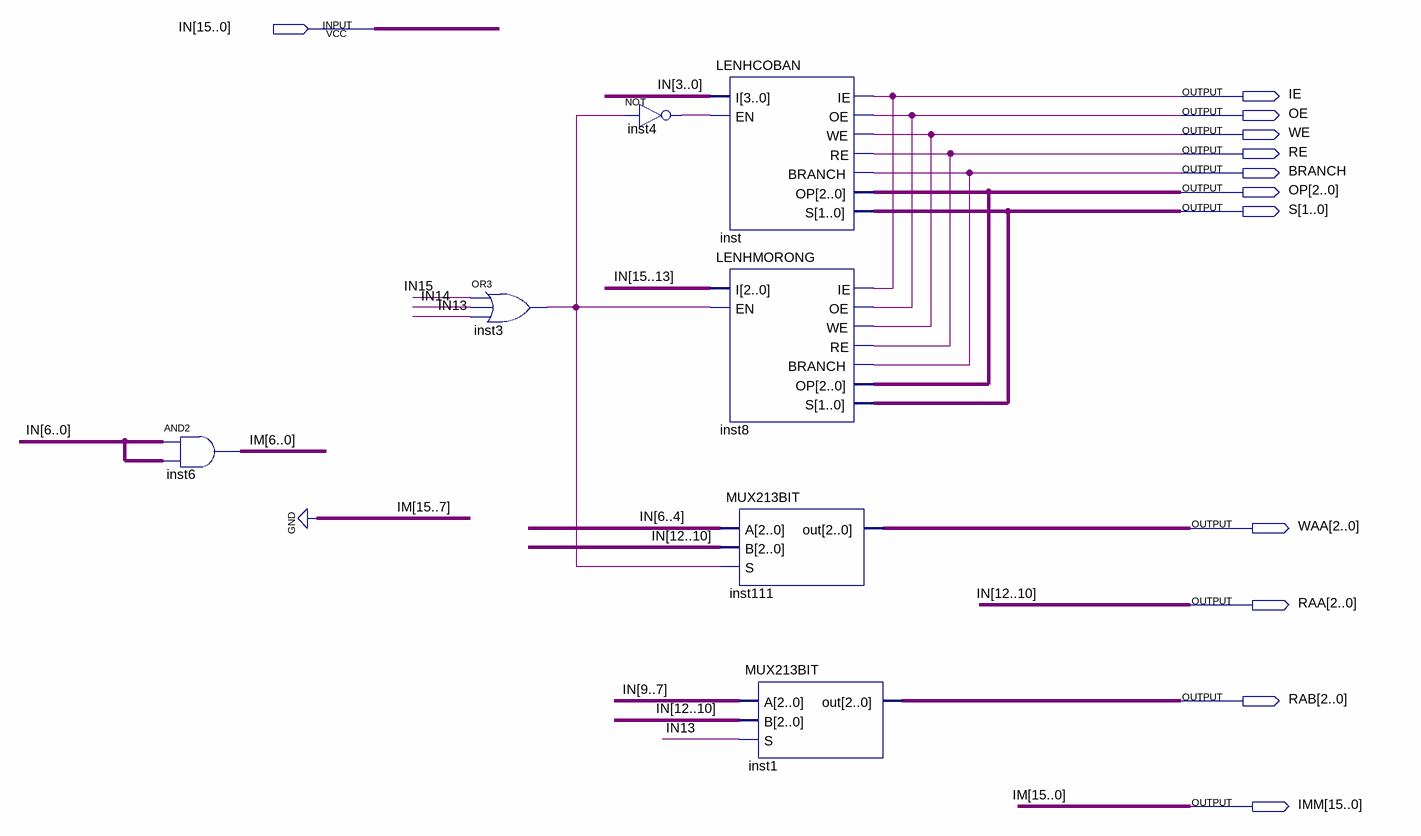
[diagram p0: schematic sheet]
// Quartus schematic CONTROLLERREAL.bdf as structural Verilog: 7 symbols, 12 pins
module CONTROLLERREAL (
  input  [15:0] IN,
  output IE,
  output OE,
  output WE,
  output RE,
  output BRANCH,
  output [2:0] OP,
  output [1:0] S,
  output [2:0] WAA,
  output [2:0] RAA,
  output [2:0] RAB,
  output [15:0] IMM
);

  wire inst3_out, inst4_out;

  assign IMM[6:0] = IN[6:0] & IN[6:0];  // AND2 inst6, 7 bits wide
  or inst3 (inst3_out, IN[15], IN[14], IN[13]);
  not inst4 (inst4_out, inst3_out);
  LENHCOBAN inst (.I(IN[3:0]), .EN(inst4_out), .IE(IE), .OE(OE), .WE(WE), .RE(RE), .BRANCH(BRANCH), .OP(OP), .S(S));
  LENHMORONG inst8 (.I(IN[15:13]), .EN(inst3_out), .IE(IE), .OE(OE), .WE(WE), .RE(RE), .BRANCH(BRANCH), .OP(OP), .S(S));
  MUX213BIT inst111 (.A(IN[6:4]), .B(IN[12:10]), .S(inst3_out), .out(WAA));
  MUX213BIT inst1 (.A(IN[9:7]), .B(IN[12:10]), .S(IN[13]), .out(RAB));

  assign IMM[15:7] = {9{1'b0}};
  assign RAA = IN[12:10];

  // Other names for the same wires on the sheet: IM[6:0] = IMM[6:0]
endmodule
